# Altium schematic sheet Charger.SchDoc: 12V Charger
size A3; CompanyName: WHE; DrawnBy: ahorat / daniw; Engineer: ahorat / daniw; SheetNumber: 3; SheetTotal: 3
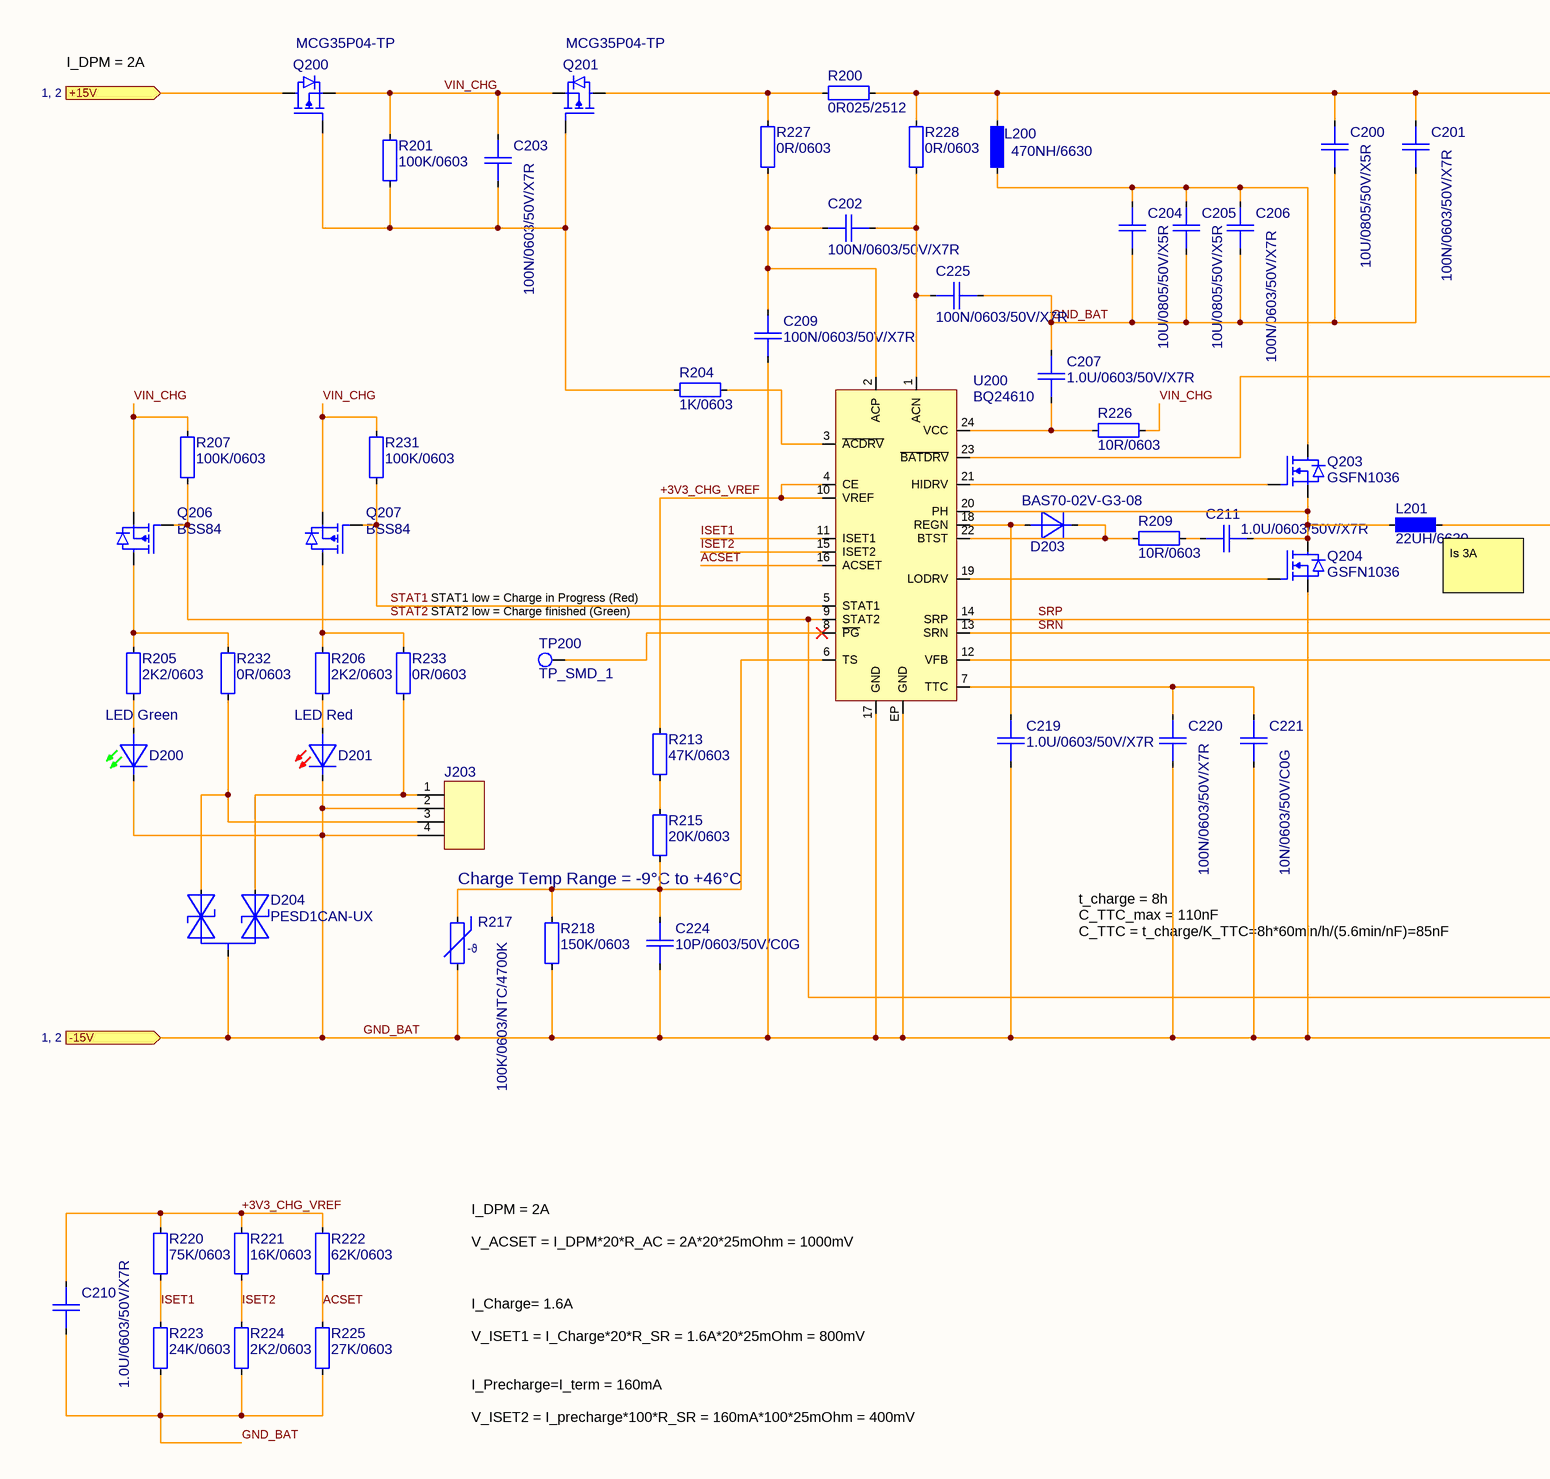
[diagram p0: Charger.SchDoc, left]
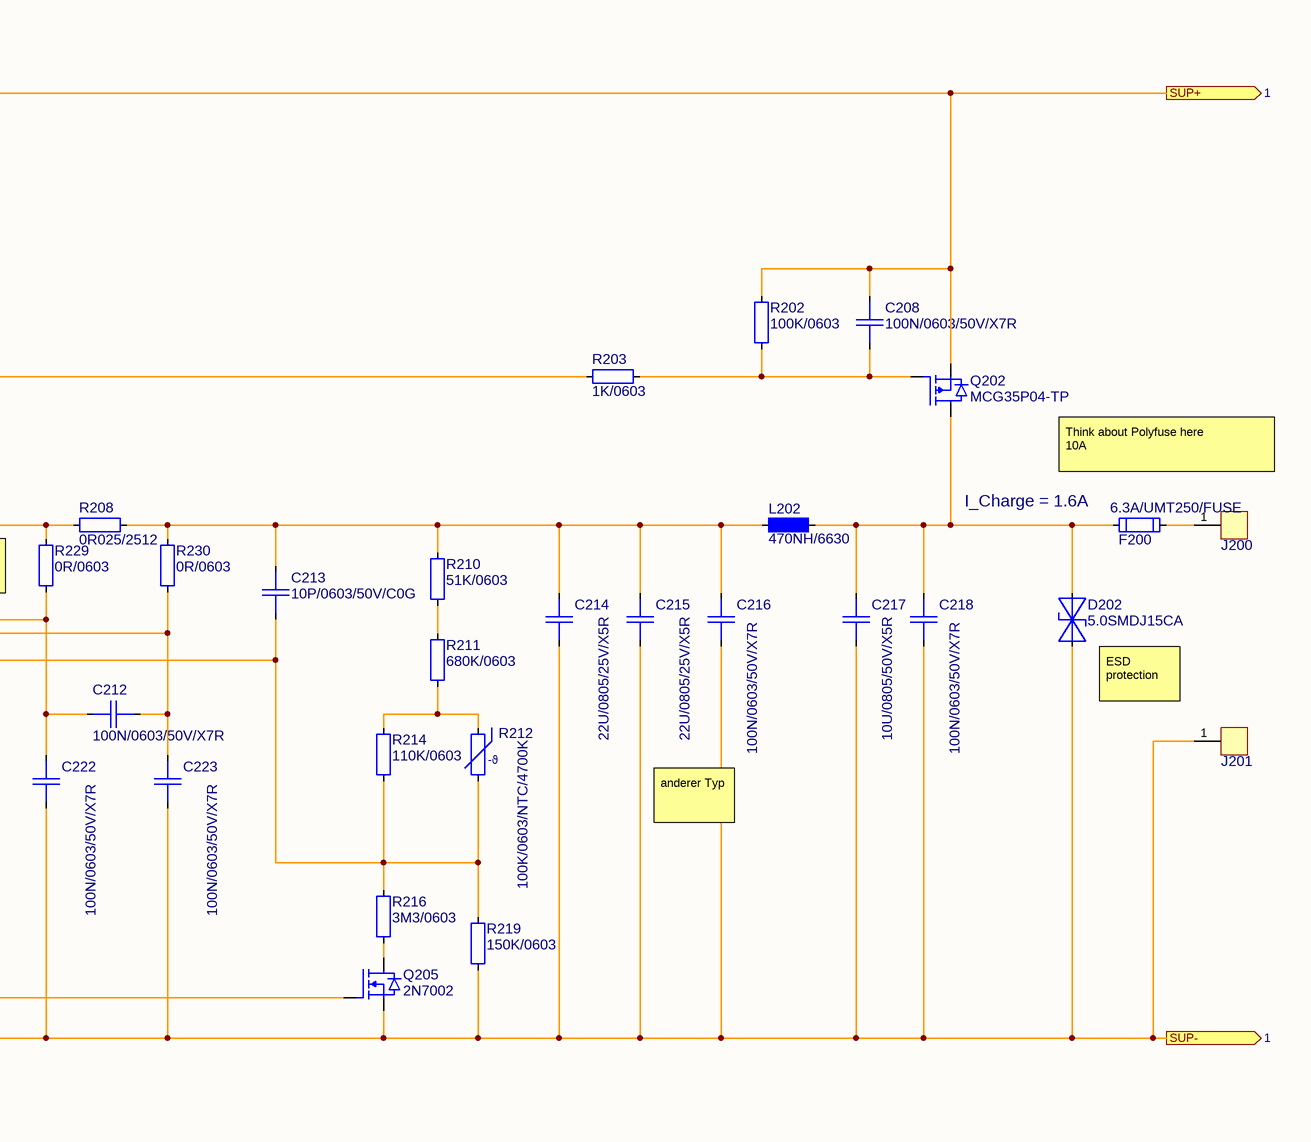
[diagram p1: Charger.SchDoc, right]

## Parts
C200  10U/0805/50V/X5R  [CAP0805_X7R]
C201  100N/0603/50V/X7R  [CAP0603_X7R]
C202  100N/0603/50V/X7R  [CAP0603_X7R]
C203  100N/0603/50V/X7R  [CAP0603_X7R]
C204  10U/0805/50V/X5R  [CAP0805_X7R]
C205  10U/0805/50V/X5R  [CAP0805_X7R]
C206  100N/0603/50V/X7R  [CAP0603_X7R]
C207  1.0U/0603/50V/X7R  [CAP0603_X7R]
C208  100N/0603/50V/X7R  [CAP0603_X7R]
C209  100N/0603/50V/X7R  [CAP0603_X7R]
C210  1.0U/0603/50V/X7R  [CAP0603_X7R]
C211  1.0U/0603/50V/X7R  [CAP0603_X7R]
C212  100N/0603/50V/X7R  [CAP0603_X7R]
C213  10P/0603/50V/C0G  [CAP0603_C0G]
C214  22U/0805/25V/X5R  [CAP0805_X7R]
C215  22U/0805/25V/X5R  [CAP0805_X7R]
C216  100N/0603/50V/X7R  [CAP0603_X7R]
C217  10U/0805/50V/X5R  [CAP0805_X7R]
C218  100N/0603/50V/X7R  [CAP0603_X7R]
C219  1.0U/0603/50V/X7R  [CAP0603_X7R]
C220  100N/0603/50V/X7R  [CAP0603_X7R]
C221  10N/0603/50V/C0G  [CAP0603_C0G]
C222  100N/0603/50V/X7R  [CAP0603_X7R]
C223  100N/0603/50V/X7R  [CAP0603_X7R]
C224  10P/0603/50V/C0G  [CAP0603_C0G]
C225  100N/0603/50V/X7R  [CAP0603_X7R]
D200  LED Green  [LED0603_GREEN]
D201  LED Red  [LED0603_RED]
D202  5.0SMDJ15CA  [DIOM7959X265]
D203  BAS70-02V-G3-08  [SOD1608X065]
D204  PESD1CAN-UX  [SOT65P210X95-3-SE]
F200  6.3A/UMT250/FUSE  [UMT250]
J200  6.35mmx0.81mm Tab THT  [Tab_THT_635]  (value not drawn)
J201  6.35mmx0.81mm Tab THT  [Tab_THT_635]  (value not drawn)
J203  5600200420  [5600200420]  (value not drawn)
L200  470NH/6630  [INDM660730X30]
L201  22UH/6630  [INDM660730X30]
L202  470NH/6630  [INDM660730X30]
Q200  MCG35P04-TP  [SON065P330X330X075-5-TH245X175]
Q201  MCG35P04-TP  [SON065P330X330X075-5-TH245X175]
Q202  MCG35P04-TP  [SON065P330X330X075-5-TH245X175]
Q203  GSFN1036  [SON065P330X330X075-5-TH245X175]
Q204  GSFN1036  [SON065P330X330X075-5-TH245X175]
Q205  2N7002  [SOT2395P280X125-3-SE]
Q206  BSS84  [SOT2395P280X125-3-SE]
Q207  BSS84  [SOT2395P280X125-3-SE]
R200  0R025/2512  [R2512-0.65-WW]
R201  100K/0603  [R0603-0.40-WW]
R202  100K/0603  [R0603-0.40-WW]
R203  1K/0603  [R0603-0.40-WW]
R204  1K/0603  [R0603-0.40-WW]
R205  2K2/0603  [R0603-0.40-WW]
R206  2K2/0603  [R0603-0.40-WW]
R207  100K/0603  [R0603-0.40-WW]
R208  0R025/2512  [R2512-0.65-WW]
R209  10R/0603  [R0603-0.40-WW]
R210  51K/0603  [R0603-0.40-WW]
R211  680K/0603  [R0603-0.40-WW]
R212  100K/0603/NTC/4700K  [R0603-0.40-WW]
R213  47K/0603  [R0603-0.40-WW]
R214  110K/0603  [R0603-0.40-WW]
R215  20K/0603  [R0603-0.40-WW]
R216  3M3/0603  [R0603-0.40-WW]
R217  100K/0603/NTC/4700K  [R0603-0.40-WW]
R218  150K/0603  [R0603-0.40-WW]
R219  150K/0603  [R0603-0.40-WW]
R220  75K/0603  [R0603-0.40-WW]
R221  16K/0603  [R0603-0.40-WW]
R222  62K/0603  [R0603-0.40-WW]
R223  24K/0603  [R0603-0.40-WW]
R224  2K2/0603  [R0603-0.40-WW]
R225  27K/0603  [R0603-0.40-WW]
R226  10R/0603  [R0603-0.40-WW]
R227  0R/0603  [R0603-0.40-WW]
R228  0R/0603  [R0603-0.40-WW]
R229  0R/0603  [R0603-0.40-WW]
R230  0R/0603  [R0603-0.40-WW]
R231  100K/0603  [R0603-0.40-WW]
R232  0R/0603  [R0603-0.40-WW]
R233  0R/0603  [R0603-0.40-WW]
TP200  TP_SMD_1  [TP_SMD_1]  (no BOM)
U200  BQ24610  [QFN050P400X400X100-24-TH245X245]

## Ports
+15V (in, see 1, 2), -15V (in, see 1, 2), SUP+ (out, see 1), SUP- (out, see 1)

## Nets
+3V3_CHG_VREF: C210.1 R213.1 R220.1 R221.1 R222.1 U200.4(CE) U200.10(VREF)
+15V: Q200.D(DRAIN) ; port +15V
ACSET: R222.2 R225.1 U200.16(ACSET)
GND_BAT: C200.2 C201.2 C204.2 C205.2 C206.2 C207.1 C209.2 C210.2 C214.2 C215.2 C216.2 C217.2 C218.2 C219.1 C220.2 C221.2 C222.2 C223.2 C224.2 C225.2 D200.1 D201.1 D202.2 D204.3 J201.1 J203.2 J203.4 Q204.S(SOURCE) Q205.2(SOURCE) R217.2 R218.2 R219.2 R223.2 R224.2 R225.2 U200.17(GND) U200.EP(GND) ; port -15V, port SUP-
ISET1: R220.2 R223.1 U200.11(ISET1)
ISET2: R221.2 R224.1 U200.15(ISET2)
SRN: C212.2 C223.1 R230.2 U200.13(SRN)
SRP: C212.1 C222.1 R229.2 U200.14(SRP)
STAT1: Q207.1(GATE) R231.2 U200.5(STAT1)
STAT2: Q205.1(GATE) Q206.1(GATE) R207.2 U200.9(STAT2)
SUP+: C200.1 C201.1 C208.1 L200.1 Q202.S(SOURCE) R200.2 R202.1 R228.1 ; port SUP+
VIN_CHG: C203.1 Q200.S(SOURCE) Q201.S(SOURCE) Q206.2(SOURCE) Q207.2(SOURCE) R201.1 R207.1 R226.2 R231.1
NetC202_1: C202.1 C209.1 R227.2 U200.2(ACP)
NetC202_2: C202.2 C225.1 R228.2 U200.1(ACN)
NetC203_2: C203.2 Q200.G(GATE) Q201.G(GATE) R201.2 R204.1
NetC204_1: C204.1 C205.1 C206.1 L200.2 Q203.D(DRAIN)
NetC207_2: C207.2 R226.1 U200.24(VCC)
NetC208_2: C208.2 Q202.G(GATE) R202.2 R203.2
NetC211_1: C211.1 R209.2
NetC211_2: C211.2 L201.1 Q203.S(SOURCE) Q204.D(DRAIN) U200.20(PH)
NetC213_1: C213.1 C214.1 C215.1 C216.1 L202.2 R208.2 R210.1 R230.1
NetC213_2: C213.2 R212.2 R214.2 R216.1 R219.1 U200.12(VFB)
NetC217_1: C217.1 C218.1 D202.1 F200.1 L202.1 Q202.D(DRAIN)
NetC219_2: C219.2 D203.2 U200.18(REGN)
NetC220_1: C220.1 C221.1 U200.7(TTC)
NetC224_1: C224.1 R215.2 R217.1 R218.1 U200.6(TS)
NetD200_2: D200.2 R205.2
NetD201_2: D201.2 R206.2
NetD203_1: D203.1 R209.1 U200.22(BTST)
NetD204_1: D204.1 J203.1 R233.2
NetD204_2: D204.2 J203.3 R232.2
NetF200_2: F200.2 J200.1
NetL201_2: L201.2 R208.1 R229.1
NetQ201_D: Q201.D(DRAIN) R200.1 R227.1
NetQ203_G: Q203.G(GATE) U200.21(HIDRV)
NetQ204_G: Q204.G(GATE) U200.19(LODRV)
NetQ205_3: Q205.3(DRAIN) R216.2
NetQ206_3: Q206.3(DRAIN) R205.1 R232.1
NetQ207_3: Q207.3(DRAIN) R206.1 R233.1
NetR203_1: R203.1 U200.23(~{BATDRV})
NetR204_2: R204.2 U200.3(~{ACDRV})
NetR210_2: R210.2 R211.1
NetR211_2: R211.2 R212.1 R214.1
NetR213_2: R213.2 R215.1
NetTP200_1: TP200.1 U200.8(~{PG})

## Notes on the sheet
- I_DPM = 2A
- (near F200) I_Charge = 1.6A
- Think about Polyfuse here
  10A
- (near L201) Is 3A
- STAT1 low = Charge in Progress (Red)
- STAT2 low = Charge finished (Green)
- (near D202) ESD protection
- anderer Typ
- (near R215) Charge Temp Range = -9°C to +46°C
- t_charge = 8h
  C_TTC_max = 110nF
  C_TTC = t_charge/K_TTC=8h*60min/h/(5.6min/nF)=85nF
- I_DPM = 2A
  V_ACSET = I_DPM*20*R_AC = 2A*20*25mOhm = 1000mV
- I_Charge= 1.6A
  V_ISET1 = I_Charge*20*R_SR = 1.6A*20*25mOhm = 800mV
- I_Precharge=I_term = 160mA
  V_ISET2 = I_precharge*100*R_SR = 160mA*100*25mOhm = 400mV
- Date:
- Size:
- A3
- Schema:
- Layout:
- (in symbol 100K/0603/NTC/4700K) -ϑ

## Library data of the parts
C200 C204 C205 C217 = 10U/0805/50V/X5R: CAP SM 0805 10uF 50V X5R; Manufacturer: GENERIC; Manufacturer 1: Murata Electronics; Manufacturer Part Number 1: GRM21BR61H106KE43K; Absolute Value: 1E-5; Eurocircuits GPN: GPN0805106-50-X5R; Part Number: 10U/0805/50V/X5R; Package: 0805; Value: 10uF; HelpURL: https://search.murata.co.jp/Ceramy/image/img/A01X/G101/ENG/GRM21BR61H106KE43-01A.pdf; Supplier 1: Digi-Key; Supplier Part Number 1: 490-GRM21BR61H106KE43KCT-ND; Supplier 3: LCSC; Supplier Part Number 3: C440198; JLC Type: Basic; Manufacturer Part Number 3: GRM21BR61H106KE43L
C201-C203 C206 C208 C209 C212 C216 C218 C220 C222 C223 C225 = 100N/0603/50V/X7R: CAP SM 0603 100nF 50V X7R; Manufacturer: GENERIC; Manufacturer 1: YAGEO; Manufacturer Part Number 1: CC0603KPX7R9BB104; Absolute Value: 1E-7; Eurocircuits GPN: GPC0603104; Part Number: 100N/0603/50V/X7R; Package: 0603; Value: 100nF; HelpURL: https://www.yageo.com/upload/media/product/app/datasheet/mlcc/upy-gphc_x7r_6_3v-to-250v.pdf; Supplier 1: Digi-Key; Supplier Part Number 1: 311-3567-1-ND; Manufacturer 2: YAGEO; Manufacturer Part Number 2: CC0603MRX7R9BB104; Supplier 2: Digi-Key; Supplier Part Number 2: 311-4110-1-ND; Supplier 3: LCSC; Supplier Part Number 3: C14663; JLC Type: Basic
C207 C210 C211 C219 = 1.0U/0603/50V/X7R: CAP SM 0603 1.0uF 50V X7R; Manufacturer: GENERIC; Manufacturer 1: YAGEO; Manufacturer Part Number 1: CC0603KRX7R9BB105; Absolute Value: 1E-6; Eurocircuits GPN: GPC0603105; Part Number: 1.0U/0603/50V/X7R; Package: 0603; Value: 1.0uF; HelpURL: https://www.yageo.com/upload/media/product/app/datasheet/mlcc/upy-gphc_x7r_6_3v-to-250v.pdf; Supplier 1: Digi-Key; Supplier Part Number 1: 311-2082-1-ND
C213 C224 = 10P/0603/50V/C0G: CAP SM 0603 10pF 50V C0G; Manufacturer: GENERIC; Manufacturer 1: YAGEO; Manufacturer Part Number 1: CC0603JRNPO9BN100; Absolute Value: 1E-11; Eurocircuits GPN: GPC0603100-C0G; Part Number: 10P/0603/50V/C0G; Package: 0603; Value: 10pF; HelpURL: https://www.yageo.com/upload/media/product/productsearch/datasheet/mlcc/UPY-GP_NP0_16V-to-50V_18.pdf; Supplier 1: Digi-Key; Supplier Part Number 1: 311-1058-1-ND; Manufacturer 2: YAGEO; Manufacturer Part Number 2: CC0603KRNPO9BN100; Supplier 2: Digi-Key; Supplier Part Number 2: 311-4025-1-ND
C214 C215 = 22U/0805/25V/X5R: CAP SM 0805 22uF 25V X5R; Manufacturer: GENERIC; Manufacturer 1: Samsung Electro-Mechanics; Manufacturer Part Number 1: CL21A226MAYNNNE; Absolute Value: 2.2E-5; Eurocircuits GPN: GPN0805106-25; Part Number: 22U/0805/25V/X5R; Package: 0805; Value: 22uF; HelpURL: https://mm.digikey.com/Volume0/opasdata/d220001/medias/docus/339/CL21A226MAYNNNE_Spec.pdf; Supplier 1: Digi-Key; Supplier Part Number 1: 1276-CL21A226MAYNNNECT-ND; Manufacturer Part Number 3: CL21A226MAQNNNE; Supplier 3: LCSC; Supplier Part Number 3: C45783; JLC Type: Basic
C221 = 10N/0603/50V/C0G: CAP SM 0603 10nF 50V C0G; Manufacturer: GENERIC; Manufacturer 1: YAGEO; Manufacturer Part Number 1: CC0603JRNPO9BN103; Absolute Value: 1E-8; Eurocircuits GPN: GPC0603103-C0G; Part Number: 10N/0603/50V/C0G; Package: 0603; Value: 10nF; HelpURL: https://www.yageo.com/upload/media/product/productsearch/datasheet/mlcc/UPY-GP_NP0_16V-to-50V_18.pdf; Supplier 1: Digi-Key; Supplier Part Number 1: 311-3960-1-ND
D200 = LED Green 0603: Generic LED Green 0603; Manufacturer 1: Würth; Manufacturer Part Number 1: 150060VS75000; Part Number: LED Green 0603; Manufacturer: GENERIC; Package: 603; Value: Green; Absolute Value: Green; HelpURL: https://www.we-online.com/katalog/datasheet/150060VS75000.pdf; Supplier 1: Digikey; Supplier Part Number 1: 732-4980-1-ND; Manufacturer 3: Everlight Elec; Manufacturer Part Number 3: 19-217/GHC-YR1S2/3T; Supplier 3: LCSC; Supplier Part Number 3: C72043; JLC Type: Basic
D201 = LED Red 0603: Generic LED Red 0603; Manufacturer 1: Würth; Manufacturer Part Number 1: 150060RS75000; Part Number: LED Red 0603; Manufacturer: GENERIC; Package: 603; Value: Red; Absolute Value: Red; HelpURL: https://www.we-online.com/katalog/datasheet/150060RS75000.pdf; Supplier 1: Digikey; Supplier Part Number 1: 732-4978-1-ND; Manufacturer 3: Hubei KENTO Elec; Manufacturer Part Number 3: KT-0603R; Supplier 3: LCSC; Supplier Part Number 3: C2286; JLC Type: Basic
D202 = 5.0SMDJ15CA: TVS DIODE 15VWM 24.4V DO214 TR13; Manufacturer: Littelfuse Inc.; Manufacturer Part Number 1: 5.0SMDJ15CAS; Absolute Value: 15V; Part Number: 5.0SMDJ15CA; Package: DO-214AB, SMC; Value: 5.0SMDJ15CA; HelpURL: https://m.littelfuse.com/~/media/electronics/datasheets/tvs_diodes/littelfuse_tvs_diode_5_0smdjxxs_datasheet.pdf.pdf; Manufacturer 1: Littelfuse Inc.; Supplier 1: Digikey; Supplier Part Number 1: 18-5.0SMDJ15CASCT-ND; Manufacturer 2: Littelfuse Inc.; Manufacturer Part Number 2: 5.0SMDJ15CA; Supplier 2: Digikey; Supplier Part Number 2: 5.0SMDJ15CACT-ND
D203 = BAS70-02V-G3-08: Small Signal Schottky Diode; Manufacturer: Vishay; Manufacturer 1: Vishay General Semiconductor - Diodes Division; Value: 70V/100mA; Absolute Value: 70V; Part Number: BAS70-02V-G3-08; Package: SOD523; HelpURL: https://www.vishay.com/docs/85652/bas70-02v.pdf; Manufacturer Part Number 1: BAS70-02V-G3-08; Supplier 1: Digikey; Supplier Part Number 1: 112-BAS70-02V-G3-08CT-ND; Manufacturer 3: Vishay Intertech; Manufacturer Part Number 3: BAS70-02V-G3-08; Supplier 3: LCSC; Supplier Part Number 3: C3313114; JLC Type: Extended
D204 = PESD1CAN-UX: CAN bus ESD protection diode; Manufacturer: Nexperia USA Inc.; Absolute Value: 24V; Part Number: PESD1CAN-UX; Package: SOT323; Value: PESD1CAN-UX; HelpURL: https://assets.nexperia.com/documents/data-sheet/PESD1CAN-U.pdf; Manufacturer 1: Nexperia USA Inc.; Manufacturer Part Number 1: PESD1CAN-UX; Supplier 1: Digikey; Supplier Part Number 1: 1727-1306-1-ND; Manufacturer 3: Nexperia; Manufacturer Part Number 3: PESD1CAN-UX; Supplier 3: LCSC; Supplier Part Number 3: C152727
F200 = 6.3A/UMT250/FUSE: Fuse 250VAC 6.3A UMT250; Manufacturer: Schurter; Manufacturer Part Number 1: 3403.0174.24; Absolute Value: 6.3; Part Number: 6.3A/UMT250/FUSE; Package: UMT250; HelpURL: https://www.schurter.com/en/datasheet/typ_UMT_250.pdf; Manufacturer 1: Schurter; Supplier 1: Digi-Key; Supplier Part Number 1: 486-3484-1-ND; Value: 6.3A
J200 J201 = Tab_025_THT: CONN QC TAB 0.250 SOLDER; Manufacturer: GENERIC; Manufacturer 1: TE Connectivity AMP Connectors; Manufacturer Part Number 1: 1217861-1; Part Number: Tab_025_THT; HelpURL: https://www.te.com/usa-en/product-1217861-1.datasheet.pdf; Supplier 1: Digi-Key; Supplier Part Number 1: A100452CT-ND; Manufacturer 3: TE Connectivity; Manufacturer Part Number 3: 1217861-1; Supplier 3: LCSC; Supplier Part Number 3: C428480
J203 = DuraClick_1x4_VERT_SMD: DuraClik Wire-to-Board Header, Single Row, Vertical, 4 Circuits, Tin (Sn) Over Nickel, Natural; Manufacturer: Molex; Part Number: DuraClick_1x4_VERT_SMD; HelpURL: https://www.molex.com/en-us/products/part-detail/5600200420; Manufacturer 1: Molex; Manufacturer Part Number 1: 5600200420; Supplier 1: Digi-Key; Supplier Part Number 1: WM10864CT-ND
L200 L202 = 470NH/6630: FIXED IND 470NH 16.5 A 5.5 MOHM SMD; Manufacturer: GENERIC; Manufacturer 1: Pulse Electronics; Manufacturer Part Number 1: BMRA00060630R47MA1; Absolute Value: 4.7E-7; Part Number: 470NH/6630; Package: 6030; Value: 470NH; HelpURL: https://productfinder.pulseelectronics.com/api/open/part-attachments/datasheet/BMRA00060630R47MA1; Supplier 1: Digi-Key; Supplier Part Number 1: 553-BMRA00060630R47MA1CT-ND
L201 = 22UH/6630: FIXED IND 22UH     3 A 145 MOHM SMD; Manufacturer: GENERIC; Manufacturer 1: Pulse Electronics; Manufacturer Part Number 1: BMRA00060630220MA1; Absolute Value: 2.2E-5; Part Number: 22UH/6630; Package: 6030; Value: 22UH; HelpURL: https://productfinder.pulseelectronics.com/api/open/part-attachments/datasheet/BMRA00060630220MA1; Supplier 1: Digi-Key; Supplier Part Number 1: 553-BMRA00060630220MA1CT-ND
Q200-Q202 = MCG35P04-TP: 40V 35A P-Channel MOSFET; Manufacturer: Micro Commercial Co; Manufacturer Part Number 1: 353-MCG35P04-TPCT-ND; Part Number: MCG35P04-TP; HelpURL: https://www.mccsemi.com/pdf/Products/MCG35P04(DFN3333).pdf; Manufacturer 1: Micro Commercial Co; Supplier 1: Digi-Key; Supplier Part Number 1: 353-MCG35P04-TPCT-ND; Package: 8-PowerVDFN
Q203 Q204 = GSFN1036: N-Kanal 100 V 35 A (Tc) 52W (Tc) Oberflächenmontage 8-PPAK (3,1x3,05); Manufacturer: Good-Ark Semiconductor; Part Number: GSFN1036; HelpURL: https://goodarksemi.com/docs/datasheets/mosfets/GSFN1036.pdf; Manufacturer 1: Good-Ark Semiconductor; Manufacturer Part Number 1: GSFN1036; Supplier 1: Digi-Key; Supplier Part Number 1: 4786-GSFN1036CT-ND; Package: 8-PowerVDFN
Q205 = 2N7002: 60V 115mA 1.2Ω@10V,500mA 200mW 2.1V@250uA N Channel SOT-23 MOSFETs; Manufacturer: GENERIC; Manufacturer 1: Nexperia USA Inc.; Manufacturer Part Number 1: 2N7002NXAKR; Part Number: 2N7002; Package: SOT23; HelpURL: https://assets.nexperia.com/documents/data-sheet/2N7002NXAK.pdf; Supplier 1: Digi-Key; Supplier Part Number 1: 1727-8643-1-ND; Manufacturer 3: JSMSEMI; Manufacturer Part Number 3: JSMSEMI; Supplier 3: LCSC; Supplier Part Number 3: C916396; JLC Type: Extended
Q206 Q207 = BSS84: 50V P-Channel MOSFET; Manufacturer: GENERIC; Manufacturer 1: Good-Ark Semiconductor; Part Number: BSS84; Package: SOT23; HelpURL: https://goodarksemi.com/docs/datasheets/mosfets/BSS84.pdf; Manufacturer Part Number 1: BSS84; Supplier 1: Digi-Key; Supplier Part Number 1: 4786-BSS84CT-ND; Manufacturer 3: Jiangsu Changjing Electronics Technology Co., Ltd.; Manufacturer Part Number 3: BSS84; Supplier 3: LCSC; Supplier Part Number 3: C114481; JLC Type: Extended
R200 R208 = 0R025/2512: RES SM 2512 0R025; Manufacturer: GENERIC; Manufacturer 1: Ohmite; Manufacturer Part Number 1: MCS3264R025FER; Absolute Value: 0.025; Part Number: 0R025/2512; Package: 2512; Value: 0R025; HelpURL: https://www.ohmite.com/assets/docs/res_mcs.pdf?r=false; Supplier 1: Digi-Key; Supplier Part Number 1: MCS3264R025FERCT-ND
R201 R202 R207 R231 = 100K/0603: RES SM 0603 100K; Manufacturer: GENERIC; Manufacturer 1: YAGEO; Manufacturer Part Number 1: RC0603FR-13100KL; Absolute Value: 100000; Eurocircuits GPN: GPR0603100K; Part Number: 100K/0603; Package: 0603; Value: 100K; HelpURL: https://www.yageo.com/upload/media/product/productsearch/datasheet/rchip/PYu-RC_Group_51_RoHS_L_12.pdf; Supplier 1: Digi-Key; Supplier Part Number 1: 13-RC0603FR-13100KLCT-ND; Manufacturer 2: YAGEO; Manufacturer Part Number 2: RC0603FR-10100KL; Supplier 2: Digi-Key; Supplier Part Number 2: 13-RC0603FR-10100KLCT-ND; Manufacturer 3: UNI-ROYAL(Uniroyal Elec); Manufacturer Part Number 3: 0603WAF1003T5E; Supplier 3: LCSC; Supplier Part Number 3: C25803; JLC Type: Basic
R203 R204 = 1K/0603: RES SM 0603 1K; Manufacturer: GENERIC; Manufacturer 1: YAGEO; Manufacturer Part Number 1: RC0603FR-131KL; Absolute Value: 1000; Eurocircuits GPN: GPR06031K; Part Number: 1K/0603; Package: 0603; Value: 1K; HelpURL: https://www.yageo.com/upload/media/product/app/datasheet/rchip/pyu-rc_group_51_rohs_l.pdf; Supplier 1: Digi-Key; Supplier Part Number 1: 13-RC0603FR-131KLCT-ND; Manufacturer 2: YAGEO; Manufacturer Part Number 2: RC0603FR-101KL; Supplier 2: Digi-Key; Supplier Part Number 2: 13-RC0603FR-101KLCT-ND; Manufacturer 3: UNI-ROYAL(Uniroyal Elec); Manufacturer Part Number 3: 0603WAF1001T5E; Supplier 3: LCSC; Supplier Part Number 3: C21190; JLC Type: Basic
R205 R206 R224 = 2K2/0603: RES SM 0603 2K2; Manufacturer: GENERIC; Manufacturer 1: YAGEO; Manufacturer Part Number 1: RC0603FR-132K2L; Absolute Value: 2200; Eurocircuits GPN: GPR06032K2; Part Number: 2K2/0603; Package: 0603; Value: 2K2; HelpURL: https://www.yageo.com/upload/media/product/app/datasheet/rchip/pyu-rc_group_51_rohs_l.pdf; Supplier 1: Digi-Key; Supplier Part Number 1: 13-RC0603FR-132K2LCT-ND; Manufacturer 2: YAGEO; Manufacturer Part Number 2: RC0603FR-102K2L; Supplier 2: Digi-Key; Supplier Part Number 2: 13-RC0603FR-102K2LCT-ND; Manufacturer 3: YAGEO; Manufacturer Part Number 3: RC0603JR-072K2L; Supplier 3: LCSC; Supplier Part Number 3: C113303
R209 R226 = 10R/0603: RES SM 0603 10R; Manufacturer: GENERIC; Manufacturer 1: YAGEO; Manufacturer Part Number 1: RC0603FR-1310RL; Absolute Value: 10; Eurocircuits GPN: GPR060310R; Part Number: 10R/0603; Package: 0603; Value: 10R; HelpURL: https://www.yageo.com/upload/media/product/app/datasheet/rchip/pyu-rc_group_51_rohs_l.pdf; Supplier 1: Digi-Key; Supplier Part Number 1: 13-RC0603FR-1310RLCT-ND; Manufacturer 2: YAGEO; Manufacturer Part Number 2: RC0603FR-1010RL; Supplier 2: Digi-Key; Supplier Part Number 2: 13-RC0603FR-1010RLCT-ND
R210 = 51K/0603: RES SM 0603 51K; Manufacturer: GENERIC; Manufacturer 1: YAGEO; Manufacturer Part Number 1: RC0603FR-1351KL; Absolute Value: 51000; Eurocircuits GPN: GPR060351K; Part Number: 51K/0603; Package: 0603; Value: 51K; HelpURL: https://www.yageo.com/upload/media/product/app/datasheet/rchip/pyu-rc_group_51_rohs_l.pdf; Supplier 1: Digi-Key; Supplier Part Number 1: 13-RC0603FR-1351KLCT-ND; Manufacturer 2: YAGEO; Manufacturer Part Number 2: RC0603FR-1051KL; Supplier 2: Digi-Key; Supplier Part Number 2: 13-RC0603FR-1051KLCT-ND; Supplier 3: LCSC; Supplier Part Number 3: C2933234; JLC Type: Basic
R211 = 680K/0603: RES SM 0603 680K; Manufacturer: GENERIC; Manufacturer 1: YAGEO; Manufacturer Part Number 1: RC0603FR-13680KL; Absolute Value: 680000; Eurocircuits GPN: GPR0603680K; Part Number: 680K/0603; Package: 0603; Value: 680K; HelpURL: https://www.yageo.com/upload/media/product/app/datasheet/rchip/pyu-rc_group_51_rohs_l.pdf; Supplier 1: Digi-Key; Supplier Part Number 1: 13-RC0603FR-13680KLCT-ND; Manufacturer 2: YAGEO; Manufacturer Part Number 2: RC0603FR-07680KL; Supplier 2: Digi-Key; Supplier Part Number 2: 311-680KHRCT-ND
R212 R217 = 100K/0603/NTC/4700K: RES NTC SM 0603 100k 4700K; Manufacturer: GENERIC; Manufacturer 1: Panasonic Electronic Components; Manufacturer Part Number 1: ERT-J1VV104F; Absolute Value: 100000; Part Number: 100K/0603/NTC/4700K; Package: 0603; Value: 100K; HelpURL: https://industrial.panasonic.com/cdbs/www-data/pdf/AUA0000/AUA0000C8.pdf; Supplier 1: Digi-Key; Supplier Part Number 1: P124047CT-ND
R213 = 47K/0603: RES SM 0603 47K; Manufacturer: GENERIC; Manufacturer 1: YAGEO; Manufacturer Part Number 1: RC0603FR-1347KL; Absolute Value: 47000; Eurocircuits GPN: GPR060347K; Part Number: 47K/0603; Package: 0603; Value: 47K; HelpURL: https://www.yageo.com/upload/media/product/app/datasheet/rchip/pyu-rc_group_51_rohs_l.pdf; Supplier 1: Digi-Key; Supplier Part Number 1: 13-RC0603FR-1347KLCT-ND; Manufacturer 2: YAGEO; Manufacturer Part Number 2: RC0603FR-1047KL; Supplier 2: Digi-Key; Supplier Part Number 2: 13-RC0603FR-1047KLCT-ND; Manufacturer 3: UNI-ROYAL(Uniroyal Elec); Manufacturer Part Number 3: 0603WAF4702T5E; Supplier 3: LCSC; Supplier Part Number 3: C25819; JLC Type: Basic
R214 = 110K/0603: RES SM 0603 110K; Manufacturer: GENERIC; Manufacturer 1: YAGEO; Manufacturer Part Number 1: RC0603FR-13110KL; Absolute Value: 110000; Eurocircuits GPN: GPR0603110K; Part Number: 110K/0603; Package: 0603; Value: 110K; HelpURL: https://www.yageo.com/upload/media/product/productsearch/datasheet/rchip/PYu-RC_Group_51_RoHS_L_12.pdf; Supplier 1: Digi-Key; Supplier Part Number 1: 13-RC0603FR-13110KLCT-ND; Manufacturer 2: YAGEO; Manufacturer Part Number 2: RC0603FR-07110KL; Supplier 2: Digi-Key; Supplier Part Number 2: 311-110KHRCT-ND
R215 = 20K/0603: RES SM 0603 20K; Manufacturer: GENERIC; Manufacturer 1: YAGEO; Manufacturer Part Number 1: RC0603FR-1320KL; Absolute Value: 20000; Eurocircuits GPN: GPR060320K; Part Number: 20K/0603; Package: 0603; Value: 20K; HelpURL: https://www.yageo.com/upload/media/product/app/datasheet/rchip/pyu-rc_group_51_rohs_l.pdf; Supplier 1: Digi-Key; Supplier Part Number 1: 13-RC0603FR-1320KLCT-ND; Manufacturer 2: YAGEO; Manufacturer Part Number 2: RC0603FR-1020KL; Supplier 2: Digi-Key; Supplier Part Number 2: 13-RC0603FR-1020KLCT-ND
R216 = 3M3/0603: RES SM 0603 3M3; Manufacturer: GENERIC; Manufacturer 1: YAGEO; Manufacturer Part Number 1: RC0603FR-073M3L; Absolute Value: 3300000; Eurocircuits GPN: GPR06033M3; Part Number: 3M3/0603; Package: 0603; Value: 3M3; HelpURL: https://www.yageo.com/upload/media/product/app/datasheet/rchip/pyu-rc_group_51_rohs_l.pdf; Supplier 1: Digi-Key; Supplier Part Number 1: 13-RC0603FR-073M3LCT-ND
R218 R219 = 150K/0603: RES SM 0603 150K; Manufacturer: GENERIC; Manufacturer 1: YAGEO; Manufacturer Part Number 1: RC0603FR-13150KL; Absolute Value: 150000; Eurocircuits GPN: GPR0603150K; Part Number: 150K/0603; Package: 0603; Value: 150K; HelpURL: https://www.yageo.com/upload/media/product/app/datasheet/rchip/pyu-rc_group_51_rohs_l.pdf; Supplier 1: Digi-Key; Supplier Part Number 1: 13-RC0603FR-13150KLCT-ND; Manufacturer 2: YAGEO; Manufacturer Part Number 2: RC0603FR-10150KL; Supplier 2: Digi-Key; Supplier Part Number 2: 13-RC0603FR-10150KLCT-ND; Manufacturer 3: UNI-ROYAL(Uniroyal Elec); Manufacturer Part Number 3: 0603WAF1503T5E; Supplier 3: LCSC; Supplier Part Number 3: C22807; JLC Type: Basic
R220 = 75K/0603: RES SM 0603 75K; Manufacturer: GENERIC; Manufacturer 1: YAGEO; Manufacturer Part Number 1: RC0603FR-1375KL; Absolute Value: 75000; Eurocircuits GPN: GPR060375K; Part Number: 75K/0603; Package: 0603; Value: 75K; HelpURL: https://www.yageo.com/upload/media/product/app/datasheet/rchip/pyu-rc_group_51_rohs_l.pdf; Supplier 1: Digi-Key; Supplier Part Number 1: 13-RC0603FR-1375KLCT-ND; Manufacturer 2: YAGEO; Manufacturer Part Number 2: RC0603FR-1075KL; Supplier 2: Digi-Key; Supplier Part Number 2: 13-RC0603FR-1075KLCT-ND; Manufacturer 3: YAGEO; Manufacturer Part Number 3: RC0603FR-0775KL; Supplier 3: LCSC; Supplier Part Number 3: C114636; JLC Type: Basic
R221 = 16K/0603: RES SM 0603 16K; Manufacturer: GENERIC; Manufacturer 1: YAGEO; Manufacturer Part Number 1: RC0603FR-1316KL; Absolute Value: 16000; Eurocircuits GPN: GPR060316K; Part Number: 16K/0603; Package: 0603; Value: 16K; HelpURL: https://www.yageo.com/upload/media/product/productsearch/datasheet/rchip/PYu-RC_Group_51_RoHS_L_12.pdf; Supplier 1: Digi-Key; Supplier Part Number 1: 13-RC0603FR-1316KLCT-ND; Manufacturer 2: YAGEO; Manufacturer Part Number 2: RC0603FR-1016KL; Supplier 2: Digi-Key; Supplier Part Number 2: 13-RC0603FR-1016KLCT-ND
R222 = 62K/0603: RES SM 0603 62K; Manufacturer: GENERIC; Manufacturer 1: YAGEO; Manufacturer Part Number 1: RC0603FR-1362KL; Absolute Value: 62000; Eurocircuits GPN: GPR060362K; Part Number: 62K/0603; Package: 0603; Value: 62K; HelpURL: https://www.yageo.com/upload/media/product/productsearch/datasheet/rchip/PYu-RC_Group_51_RoHS_L_12.pdf; Supplier 1: Digi-Key; Supplier Part Number 1: 13-RC0603FR-1362KLCT-ND; Manufacturer 2: YAGEO; Manufacturer Part Number 2: RC0603FR-1062KL; Supplier 2: Digi-Key; Supplier Part Number 2: 13-RC0603FR-1062KLCT-ND
R223 = 24K/0603: RES SM 0603 24K; Manufacturer: GENERIC; Manufacturer 1: YAGEO; Manufacturer Part Number 1: RC0603FR-1324KL; Absolute Value: 24000; Eurocircuits GPN: GPR060324K; Part Number: 24K/0603; Package: 0603; Value: 24K; HelpURL: https://www.yageo.com/upload/media/product/app/datasheet/rchip/pyu-rc_group_51_rohs_l.pdf; Supplier 1: Digi-Key; Supplier Part Number 1: 13-RC0603FR-1324KLCT-ND; Manufacturer 2: YAGEO; Manufacturer Part Number 2: RC0603FR-1024KL; Supplier 2: Digi-Key; Supplier Part Number 2: 13-RC0603FR-1024KLCT-ND
R225 = 27K/0603: RES SM 0603 27K; Manufacturer: GENERIC; Manufacturer 1: YAGEO; Manufacturer Part Number 1: RC0603FR-1327KL; Absolute Value: 27000; Eurocircuits GPN: GPR060327K; Part Number: 27K/0603; Package: 0603; Value: 27K; HelpURL: https://www.yageo.com/upload/media/product/app/datasheet/rchip/pyu-rc_group_51_rohs_l.pdf; Supplier 1: Digi-Key; Supplier Part Number 1: 13-RC0603FR-1327KLCT-ND; Manufacturer 2: YAGEO; Manufacturer Part Number 2: RC0603FR-1027KL; Supplier 2: Digi-Key; Supplier Part Number 2: 13-RC0603FR-1027KLCT-ND; Manufacturer 3: YAGEO; Manufacturer Part Number 3: RC0603FR-0727KL; Supplier 3: LCSC; Supplier Part Number 3: C114614
R227-R230 R232 R233 = 0R/0603: RES SM 0603 0R; Manufacturer: GENERIC; Manufacturer 1: YAGEO; Manufacturer Part Number 1: RC0603FR-070RL; Absolute Value: 0; Eurocircuits GPN: GPR06030R; Part Number: 0R/0603; Package: 0603; Value: 0R; HelpURL: https://www.yageo.com/upload/media/product/app/datasheet/rchip/pyu-rc_group_51_rohs_l.pdf; Supplier 1: Digi-Key; Supplier Part Number 1: 311-0.0HRCT-ND; Manufacturer 2: YAGEO; Manufacturer Part Number 2: RC0603FR-130RL; Supplier 2: Digi-Key; Supplier Part Number 2: 13-RC0603FR-130RLCT-ND; Manufacturer 3: UNI-ROYAL(Uniroyal Elec); Manufacturer Part Number 3: 0603WAF0000T5E; Supplier 3: LCSC; Supplier Part Number 3: C21189; JLC Type: Basic
TP200 = TP_SMD_1: SMD Test Point 1mm; Manufacturer: NONE; Part Number: TP_SMD_1
U200 = BQ24610: BQ2461x Stand-Alone 1- to 6-Cell Synchronous Buck Battery Charger Controller; Manufacturer: Texas Instruments; Manufacturer Part Number 1: BQ24610RGER; Part Number: BQ24610; Package: QFN-24; HelpURL: https://www.ti.com/lit/ds/symlink/bq24610.pdf; Manufacturer 1: Texas Instruments; Supplier 1: Digi-Key; Supplier Part Number 1: 296-29437-1-ND; Manufacturer 3: Texas Instruments; Manufacturer Part Number 3: BQ24610RGER; Supplier 3: LCSC; Supplier Part Number 3: C19384